# EAGLE design Adafruit Radio FeatherWing (EAGLE 6.6.0)
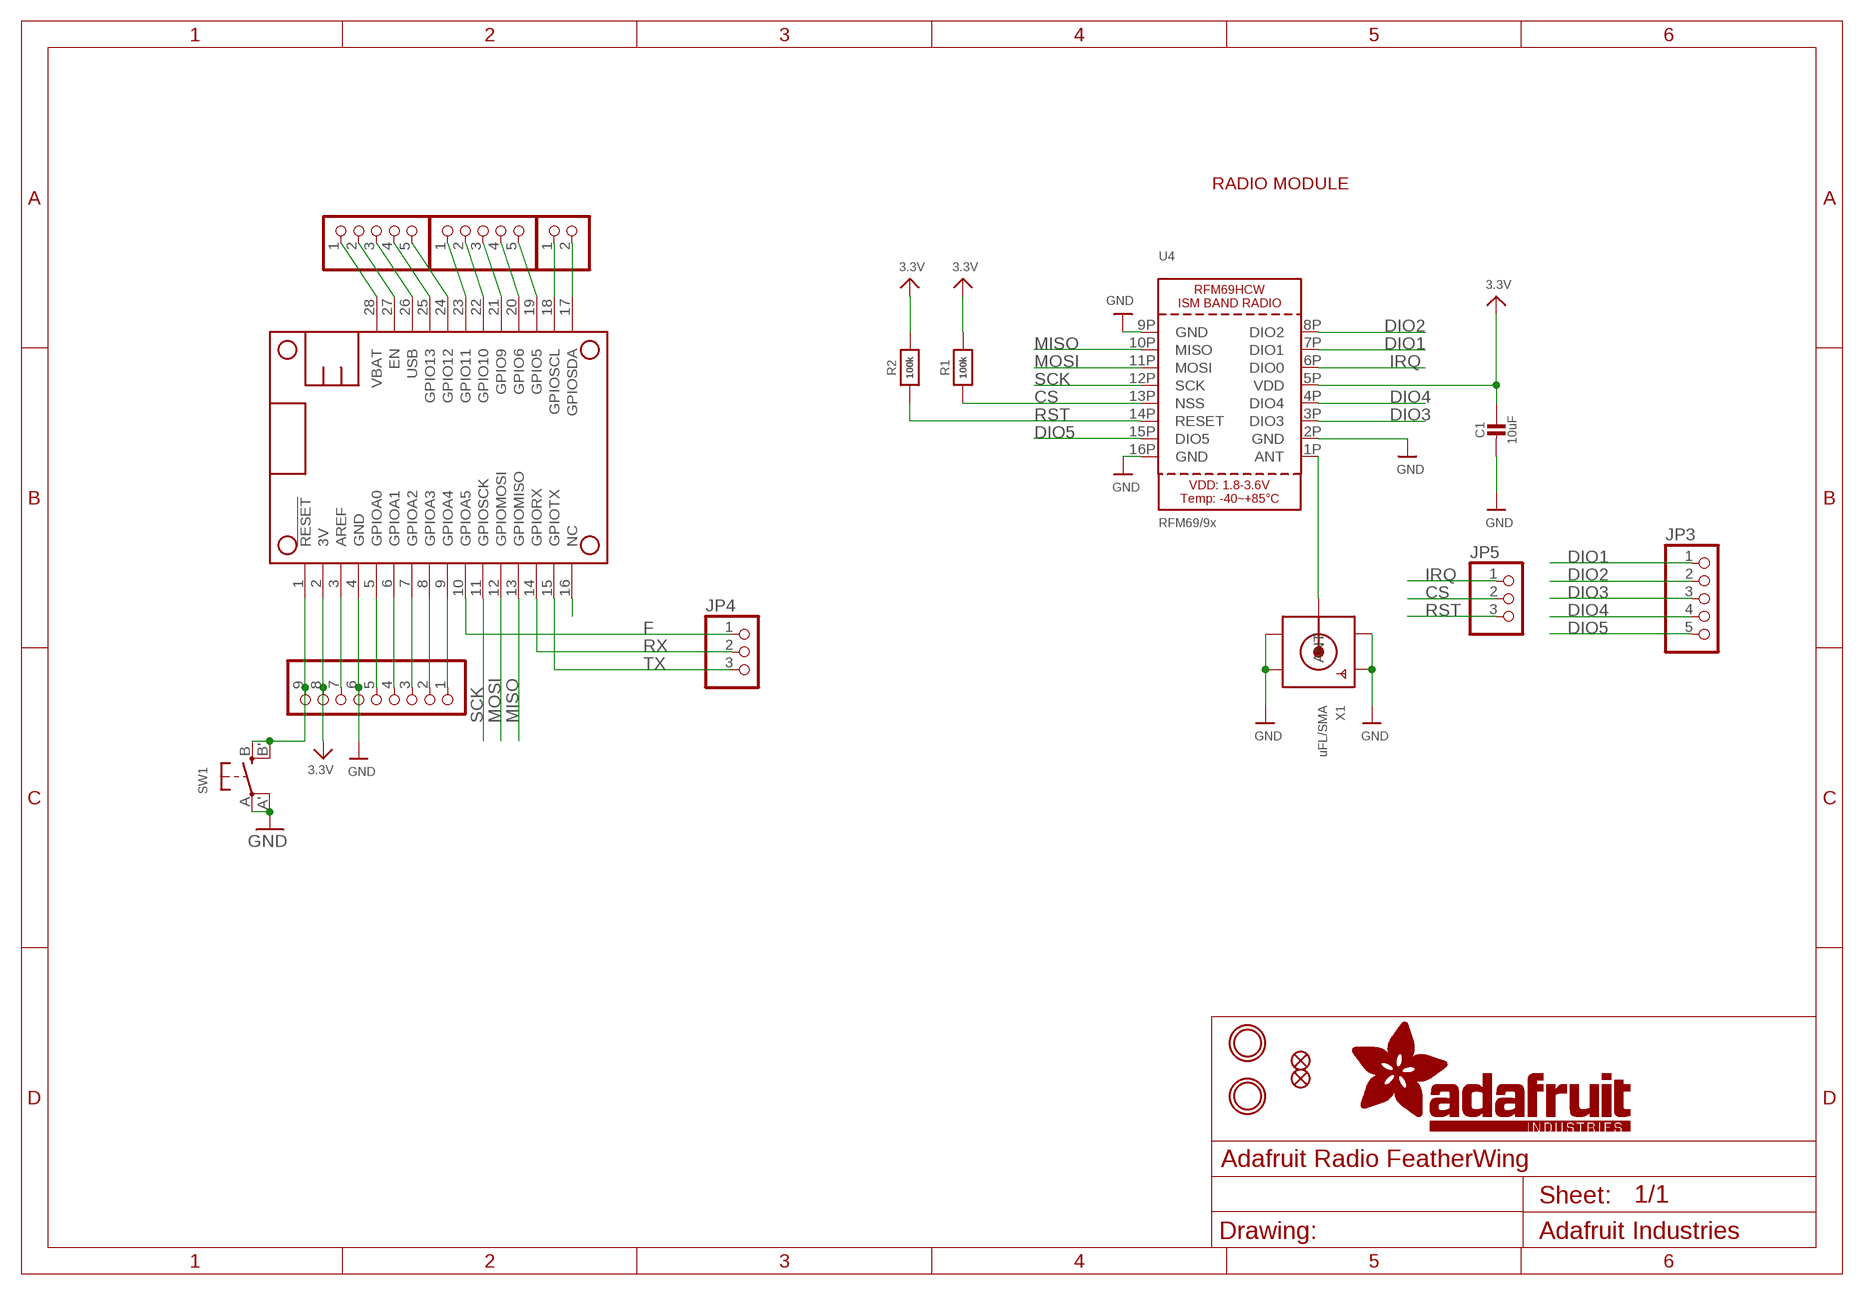
[diagram p0: schematic, sheet 1]

## Parts
C1  10uF  CAP_CERAMIC0805-NOOUTLINE  [0805-NO]
FID1  FIDUCIAL""  [FIDUCIAL_1MM]
FID2  FIDUCIAL""  [FIDUCIAL_1MM]
JP1  HEADER-1X970MIL  [1X09_ROUND_70]
JP2  HEADER-1X570MIL  [1X05_ROUND_70]
JP3  HEADER-1X570MIL  [1X05_ROUND_70]
JP4  HEADER-1X376MIL  [1X03_ROUND_76]
JP5  HEADER-1X376MIL  [1X03_ROUND_76]
JP6  HEADER-1X2ROUND  [1X02_ROUND]
JP7  HEADER-1X576MIL  [1X05_ROUND_76]
MS1  FEATHERWING_NOHOLES  [FEATHERWING_NOHOLES]
R1  100k  RESISTOR_0603_NOOUT  [0603-NO]
R2  100k  RESISTOR_0603_NOOUT  [0603-NO]
SW1  SWITCH_TACT_SMT4.6X2.8  [BTN_KMR2_4.6X2.8]
U4  RFM69/9x  RFM69HCW_SMT  [RFMHCW_SMT]
U$7  MOUNTINGHOLE2.5  [MOUNTINGHOLE_2.5_PLATED]
U$8  MOUNTINGHOLE2.5  [MOUNTINGHOLE_2.5_PLATED]
X1  uFL/SMA  SMACONNECTOR_EDGE_UFL  [SMA_EDGELAUNCH_UFL]

## Nets
3.3V: C1.1 JP1.8 MS1.2(3V) R1.2 R2.2 U4.5P(VDD)
A: JP7.1 MS1.23(GPIO11)
ANT: U4.1P(ANT) X1.P(ANT)
B: JP7.2 MS1.22(GPIO10)
C: JP7.3 MS1.21(GPIO9)
CS: JP5.2 R1.1 U4.13P(NSS)
D: JP7.4 MS1.20(GPIO6)
DIO1: JP3.1 U4.7P(DIO1)
DIO2: JP3.2 U4.8P(DIO2)
DIO3: JP3.3 U4.3P(DIO3)
DIO4: JP3.4 U4.4P(DIO4)
DIO5: JP3.5 U4.15P(DIO5)
E: JP7.5 MS1.19(GPIO5)
EN: JP2.2 MS1.27(EN)
F: JP4.1 MS1.10(GPIOA5)
G: JP2.5 MS1.24(GPIO12)
GND: C1.2 JP1.6 MS1.4(GND) SW1.A'(P1) SW1.A(P) U4.2P(GND) U4.9P(GND) U4.16P(GND) X1.GND@1(GND1) X1.GND@2(GND2) X1.GND@3(GND3) X1.GND@4(GND4)
H: JP2.4 MS1.25(GPIO13)
I: JP1.5 MS1.5(GPIOA0)
IRQ: JP5.1 U4.6P(DIO0)
J: JP1.4 MS1.6(GPIOA1)
K: JP1.3 MS1.7(GPIOA2)
L: JP1.2 MS1.8(GPIOA3)
M: JP1.1 MS1.9(GPIOA4)
MISO: MS1.13(GPIOMISO) U4.10P(MISO)
MOSI: MS1.12(GPIOMOSI) U4.11P(MOSI)
N$7: JP1.7 MS1.3(AREF)
N$25: JP1.9 MS1.1(!RESET) SW1.B'(S1) SW1.B(S)
NC: MS1.16(NC)
RST: JP5.3 R2.1 U4.14P(RESET)
RX: JP4.2 MS1.14(GPIORX)
SCK: MS1.11(GPIOSCK) U4.12P(SCK)
SCL: JP6.1 MS1.18(GPIOSCL)
SDA: JP6.2 MS1.17(GPIOSDA)
TX: JP4.3 MS1.15(GPIOTX)
USB: JP2.3 MS1.26(USB)
VBAT: JP2.1 MS1.28(VBAT)

## Notes on the sheet
- RADIO MODULE

## Library data of the parts
C1 = microbuilder:CAP_CERAMIC: Ceramic Capacitors For new designs, use the packages preceded by an '_' character since they are more reliable: The following footprints should be used on most boards: _0402 - Standard footprint for regular board layouts _0603 - Standard footprint for regular board layouts _0805 - Standard footprint for regular board layouts _1206 - Standard footprint for regular board layouts For extremely tight-pitch boards where space is at a premium, the following 'micro-pitch' footprints can be used (smaller pads, no silkscreen outline, etc.): _0402MP - Micro-pitch footprint for very dense/compact boards _0603MP - Micro-pitch footprint for very dense/compact boards _0805MP - Micro-pitch footprint for very dense/compact boards _1206MP - Micro-pitch footprint for very dense/compact boards
FID1 FID2 = microbuilder:FIDUCIAL: Fiducial Alignment Points Various fiducial points for machine vision alignment.; BOM: EXCLUDE
JP1 = microbuilder:HEADER-1X9: PIN HEADER
JP2 JP3 JP7 = microbuilder:HEADER-1X5: PIN HEADER
JP4 JP5 = microbuilder:HEADER-1X3: PIN HEADER
JP6 = microbuilder:HEADER-1X2: PIN HEADER
MS1 = microbuilder:FEATHERWING
R1 R2 = microbuilder:RESISTOR: Resistors For new designs, use the packages preceded by an '_' character since they are more reliable: The following footprints should be used on most boards: _0402 - Standard footprint for regular board layouts _0603 - Standard footprint for regular board layouts _0805 - Standard footprint for regular board layouts _1206 - Standard footprint for regular board layouts For extremely tight-pitch boards where space is at a premium, the following 'micro-pitch' footprints can be used (smaller pads, no silkscreen outline, etc.): _0402MP - Micro-pitch footprint for very dense/compact boards _0603MP - Micro-pitch footprint for very dense/compact boards _0805MP - Micro-pitch footprint for very dense/compact boards _1206MP - Micro-pitch footprint for very dense/compact boards
SW1 = microbuilder:SWITCH_TACT_SMT: SMT Tact Switches 6x6mm - Digikey: P12940SCT-ND KMR2 (4.6x2.8mm) - Digikey: 401-1426-1-ND EVQ-PQHB55 - Light Touch, 160GF (4.5x4.5mm) - Digikey: P8090SCT-ND KMT0 - KMT021 NGJ LHS (etc.) IP68/Waterproof - Digikey: CKN10289CT-ND
U4 = microbuilder:RFM69HCW: RFM69HCW - ISM Band RF Transceiver
U$7 U$8 = microbuilder:MOUNTINGHOLE: Mounting Hole For #2 screws (0.086"/2.18mm width, 0.094"/2.4mm hole) use 2.5mm; BOM: EXCLUDE
X1 = microbuilder:SMACONNECTOR: SMA Connector 90° DIP SMA Connector, 50 Ohm (4UConnector: 07259)

## Board
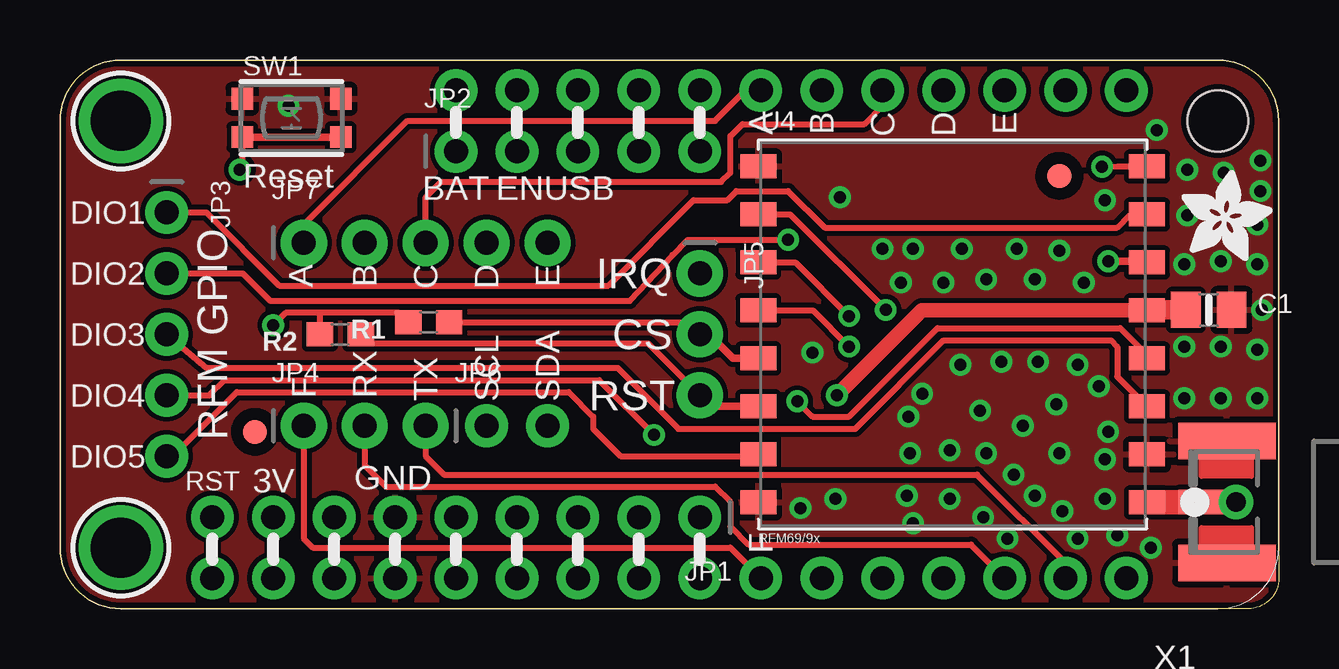
[diagram p1: board, top side]
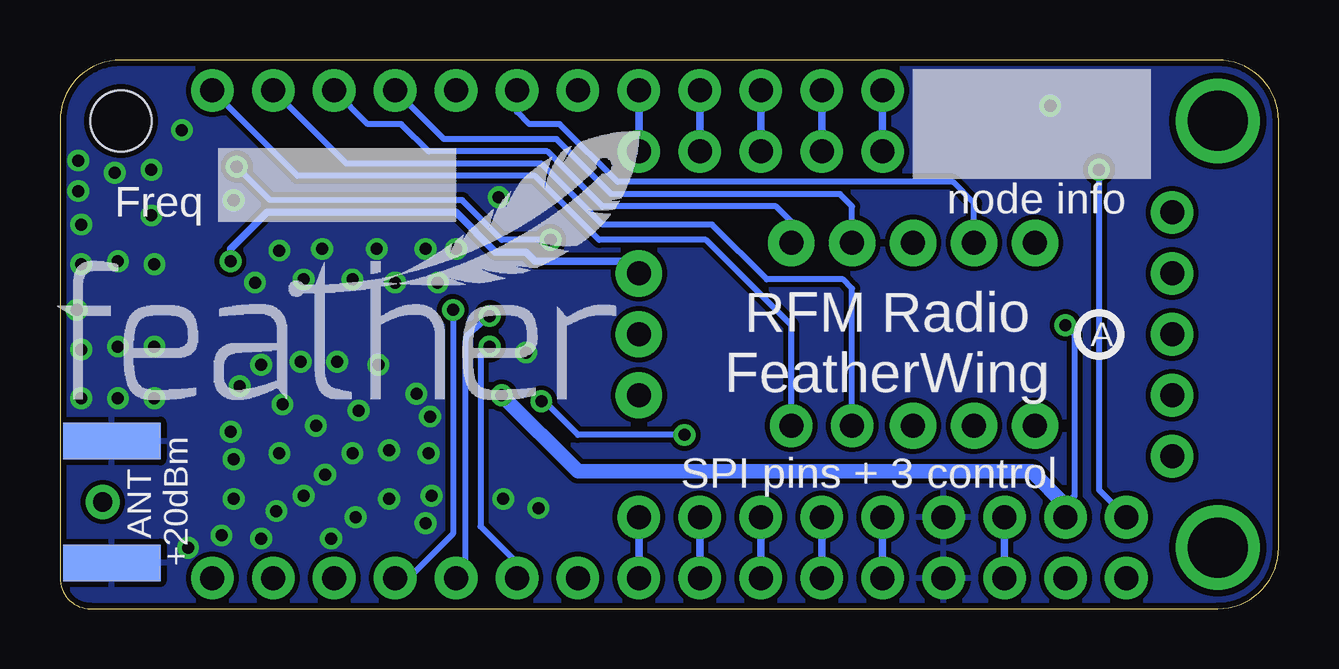
[diagram p2: board, bottom side, seen from below]

Size 50.8 x 22.86 mm. Coordinates in mm from the lower left corner, seen from the top.
Outline: 50.8,20.32 50.8,1.27 arc-90 49.53,0 2.54,0 arc-90 0,2.54 0,20.32 arc-90 2.54,22.86 48.26,22.86 arc-90 50.8,20.32
Copper layers (1*16): Top 0.035mm / dielectric 1.5mm / Bottom 0.035mm
Design rules "adafruit": minimum track width 8mil, minimum drill 15.5mil, track to track 8mil, track to pad 8mil, pad to pad 8mil, via to via 8mil, smd to smd 8mil, copper to edge 10mil, drill to drill 8mil, minimum pad ring 10mil, minimum via ring 8mil, stop-mask expansion 2mil, vias tented up to drill 20mil, thermal gap 10mil
Holes 2.54 mm at 48.26,20.32

### Footprints (pad centres in the part's own frame; a part is rotated, then mirrored left to right if it is on the bottom)
0805-NO = smd 1.24 x 1.5: 1 -0.95,0; 2 0.95,0
FIDUCIAL_1MM = smd 1 x 1: 1 0,0
1X09_ROUND_70 = drill 1 pad 1.778: 1 -10.16,0; 2 -7.62,0; 3 -5.08,0; 4 -2.54,0; 5 0,0; 6 2.54,0; 7 5.08,0; 8 7.62,0; 9 10.16,0
1X05_ROUND_70 = drill 1 pad 1.778: 1 -5.08,0; 2 -2.54,0; 3 0,0; 4 2.54,0; 5 5.08,0
1X03_ROUND_76 = drill 1 pad 1.93: 1 -2.54,0; 2 0,0; 3 2.54,0
1X02_ROUND = drill 1 pad 1.778: 1 -1.27,0; 2 1.27,0
1X05_ROUND_76 = drill 1 pad 1.93: 1 -5.08,0; 2 -2.54,0; 3 0,0; 4 2.54,0; 5 5.08,0
FEATHERWING_NOHOLES = drill 1 pad 1.778: 1 6.35,1.27; 2 8.89,1.27; 3 11.43,1.27; 4 13.97,1.27; 5 16.51,1.27; 6 19.05,1.27; 7 21.59,1.27; 8 24.13,1.27; 9 26.67,1.27; 10 29.21,1.27; 11 31.75,1.27; 12 34.29,1.27; 13 36.83,1.27; 14 39.37,1.27; 15 41.91,1.27; 16 44.45,1.27; 17 44.45,21.59; 18 41.91,21.59; 19 39.37,21.59; 20 36.83,21.59; 21 34.29,21.59; 22 31.75,21.59; 23 29.21,21.59; 24 26.67,21.59; 25 24.13,21.59; 26 21.59,21.59; 27 19.05,21.59; 28 16.51,21.59
0603-NO = smd 1.1 x 1: 1 -0.85,0; 2 0.85,0
BTN_KMR2_4.6X2.8 = smd 0.9 x 0.9: A 2.05,0.8; A' -2.05,0.8; B 2.05,-0.8; B' -2.05,-0.8
RFMHCW_SMT = smd 1.5 x 1: 1P 8.1,-7; 2P 8.1,-5; 3P 8.1,-3; 4P 8.1,-1; 5P 8.1,1; 6P 8.1,3; 7P 8.1,5; 8P 8.1,7; 9P -8.1,7; 10P -8.1,5; 11P -8.1,3; 12P -8.1,1; 13P -8.1,-1; 14P -8.1,-3; 15P -8.1,-5; 16P -8.1,-7
MOUNTINGHOLE_2.5_PLATED = drill 2.5 pad 3.2: P$1 0,0
SMA_EDGELAUNCH_UFL = smd 4.064 x 1.524: GND@1 2.032,-2.54; GND@2 2.032,2.54 | smd 4.064 x 1.524 bottom: GND@3 2.032,2.54; GND@4 2.032,-2.54 | smd 2.032 x 1.016: P 3.048,0

### Placement (x,y rotation side)
C1  47.88,12.45 0 top
FID1  8.13,7.37 0 top
FID2  41.66,18.03 0 top
JP1  16.51,3.81 180 top
JP2  21.59,19.05 0 top
JP3  4.45,11.43 270 top
JP4  12.7,7.62 0 top
JP5  26.67,11.43 270 top
JP6  19.05,7.62 0 top
JP7  15.24,15.24 0 top
MS1  0,0 0 top
R1  15.37,11.94 180 top
R2  11.68,11.43 180 top
SW1  9.65,20.45 0 top
U4  37.21,11.43 0 top
U$7  2.54,2.54 0 top
U$8  2.54,20.32 0 top
U$14  [PCBFEAT-REV-040]  7.49,11.43 0 bottom
U$15  [ADAFRUIT_3.5MM]  46.74,14.48 0 top
U$16  [FEATHERLOGO]  50.93,8.64 0 bottom
X1  50.67,4.45 180 top

### Tracks (layer width: path | path; a pad name or v marks a point on that pad's centre or on a via)
3.3V  (via drill 0.5)
  Top 0.254: R1.2 14.14,12.32 10.79,12.32 | 10.79,12.32 9.4,12.32 v8.89,11.81 | R2.2 10.83,12.28 10.79,12.32
  Top 0.305: MS1.2 JP1.8
  Top 0.61: v32.38,8.89 35.92,12.43 U4.5P
  Top 0.813: C1.1 45.33,12.45 U4.5P
  Bottom 0.254: v8.89,11.81 8.51,11.43 8.51,4.7 8.89,4.32
  Bottom 0.61: JP1.8 8.89,4.32 10.29,5.71 29.21,5.71 v32.38,8.89
A
  Top 0.254: JP7.1 10.16,16 14.48,20.32 27.3,20.32 28.57,21.59 MS1.23
ANT  (via drill 0.8 pad 1.42)
  Top 0.254: v49.02,4.45 X1.P
  Top 1.016: U4.1P 47.36,4.43 X1.P
B
  Bottom 0.254: JP7.2 12.7,16.89 13.59,17.78 27.56,17.78 29.97,20.19 31.24,20.19 31.75,20.7 MS1.22
C
  Top 0.254: JP7.3 15.24,17.14 15.88,17.78 27.56,17.78 27.94,18.16 27.94,19.68 28.45,20.19 33.53,20.19 34.29,20.95 MS1.21
CS
  Top 0.254: R1.1 26.16,11.94 JP5.2
  Top 0.305: JP5.2 27.05,11.43 28.05,10.43 U4.13P
D
  Bottom 0.254: JP7.4 17.78,16.76 18.29,17.27 27.81,17.27 30.1,19.56 34.8,19.56 MS1.20
DIO1
  Top 0.254: JP3.1 6.1,16.51 9.14,13.46 22.86,13.46 26.42,17.02 27.81,17.02 28.19,17.4 30.35,17.4 31.88,15.88 44.07,15.88 44.58,16.38 45.26,16.38 U4.7P
DIO2  (via drill 0.5)
  Top 0.254: JP3.2 7.62,13.97 8.76,12.83 23.75,12.83 25.53,14.73 26.16,15.37 v30.35,15.37 | v43.43,18.41 44.08,18.43 U4.8P
  Bottom 0.254: v30.35,15.37 32.38,15.37 34.04,17.02 42.04,17.02 v43.43,18.41
DIO3
  Top 0.254: 45.14,8.26 U4.3P 44.07,9.67 44.07,10.92 43.81,11.18 36.83,11.18 33.15,7.49 25.78,7.49 23.24,10.03 6.1,10.03 JP3.3
DIO4  (via drill 0.5)
  Top 0.254: JP3.4 6.22,8.89 6.86,9.53 22.48,9.53 v24.77,7.24 | v30.73,8.64 31.37,8 32.89,8 36.58,11.68 44.2,11.68 45.21,10.67 45.21,10.54 45.3,10.41 U4.4P
  Bottom 0.254: v24.77,7.24 29.21,7.24 30.73,8.76 v30.73,8.64
DIO5
  Top 0.254: JP3.5 4.7,6.35 7.37,9.02 21.21,9.02 22.23,8 22.23,7.49 23.37,6.35 29.03,6.35 U4.15P
E
  Bottom 0.254: JP7.5 20.32,16.13 20.95,16.76 28.19,16.76 30.48,19.05 35.43,19.05 36.58,20.19 37.97,20.19 MS1.19
EN
  Bottom 0.305: MS1.27 JP2.2
F
  Top 0.254: JP4.1 10.16,2.92 10.54,2.54 27.94,2.54 MS1.10
G
  Bottom 0.305: MS1.24 JP2.5
GND  (via drill 0.5)
  other vias: 9.53,20.95 30.86,4.19 32.51,17.14 46.99,18.29 48.39,10.92 46.86,14.35 49.91,8.76 48.39,8.76 50.04,18.67 49.91,10.79 42.42,2.92 41.78,4.06 43.69,7.37 48.39,14.48 48.51,18.16 50.04,17.4 43.31,9.27 35.43,6.48 35.37,8 40.77,10.29 42.42,10.16 39.24,10.29 39.88,14.99 35.56,14.99 35.94,8.95 31.37,10.67 32.32,4.57 37.53,10.16 38.48,3.81 37.59,14.99 34.29,14.99 43.56,17.02 45.72,19.94 46.86,10.92 46.86,8.76 50.1,12.45 45.47,2.54 49.91,14.35 41.66,6.48 38.61,6.48 39.75,5.59 43.56,6.22 43.56,4.57 40.64,4.7 44.07,3.05 46.99,16.38 49.91,16 37.08,6.6 41.66,14.92 38.35,8.26 41.53,8.51 40.13,7.62 35.31,4.7 35.56,3.56 39.5,2.92 37.08,4.57 35.05,13.59 36.83,13.59 38.61,13.72 40.64,13.72 42.67,13.59
  pour Top: 0,22.86 0,0 50.8,0 50.8,22.86
  pour Bottom: 0,22.86 0,0 50.8,0 50.8,22.86
H
  Bottom 0.305: MS1.25 JP2.4
I
  Bottom 0.305: JP1.5 MS1.5
IRQ  (via drill 0.5)
  Top 0.305: v43.69,14.48 45.26,14.48 U4.6P
  Bottom 0.305: JP5.1 27.18,14.48 30.99,14.48 31.37,14.86 32.64,14.86 34.29,16.51 42.16,16.51 43.69,14.99 v43.69,14.48
J
  Bottom 0.305: MS1.6 JP1.4
K
  Bottom 0.305: MS1.7 JP1.3
L
  Bottom 0.305: MS1.8 JP1.2
M
  Bottom 0.305: MS1.9 JP1.1
MISO  (via drill 0.5)
  Top 0.254: U4.10P 30.43,16.43 v34.42,12.45
  Bottom 0.254: v34.42,12.45 34.42,3.11 36.26,1.27 MS1.13
MOSI  (via drill 0.5)
  Top 0.254: U4.11P 30.66,14.43 v32.89,12.19
  Bottom 0.254: v32.89,12.19 33.85,11.37 33.91,11.11 33.91,1.65 MS1.12
N$7
  Bottom 0.305: JP1.7 MS1.3
N$25  (via drill 0.5)
  Top 0.254: SW1.B' 7.6,18.4 v7.49,18.29
  Top 0.305: JP1.9 MS1.1 | SW1.B SW1.B'
  Bottom 0.254: v7.49,18.29 7.49,4.95 JP1.9
RST
  Top 0.254: R2.1 12.91,11.05 24.51,11.05 JP5.3
  Top 0.305: JP5.3 27.13,8.43 U4.14P
RX
  Top 0.254: JP4.2 12.7,5.97 13.59,5.08 27.3,5.08 27.94,4.45 27.94,3.43 28.7,2.67 37.97,2.67 MS1.14
SCK  (via drill 0.5)
  Top 0.254: U4.12P 31.39,12.43 v32.89,10.92
  Bottom 0.254: v32.89,10.92 33.27,10.54 33.27,3.43 31.75,1.91 MS1.11
SCL
  Bottom 0.254: JP6.1 17.78,13.34 18.16,13.72 21.34,13.72 23.62,16 28.19,16 30.73,18.54 38.86,18.54 MS1.18
SDA
  Bottom 0.254: JP6.2 20.32,11.81 23.88,15.37 28.32,15.37 30.99,18.03 40.89,18.03 MS1.17
TX
  Top 0.254: JP4.3 15.24,6.35 16,5.59 38.23,5.59 41.91,1.91 MS1.15
USB
  Bottom 0.305: MS1.26 JP2.3
VBAT
  Bottom 0.305: MS1.28 JP2.1

### Text on the board
tPlace: A | B | C | D | E | Reset | BAT | EN | USB | DIO1 | DIO2 | A | B | C | D | E | IRQ | DIO3 | RFM GPIO | CS | DIO4 | F | RX | TX | SCL | SDA | RST | DIO5 | RST | 3V | GND | F
bPlace: node info | Freq | RFM Radio / FeatherWing | SPI pins + 3 control | ANT | +20dBm